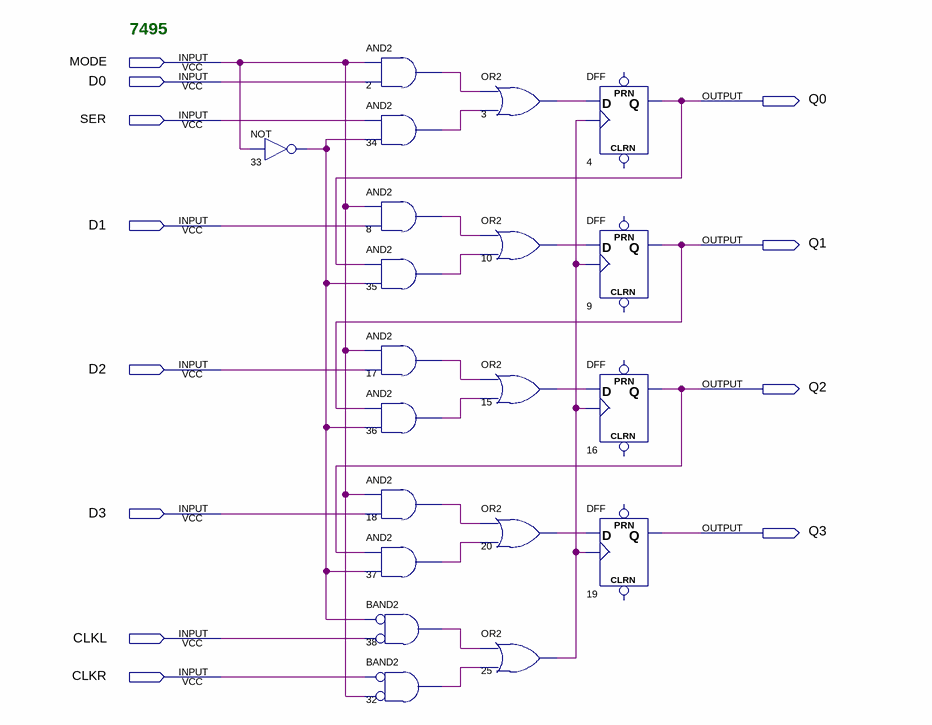
[diagram p0: schematic sheet]
// Quartus schematic 7495.bdf as structural Verilog: 20 symbols, 12 pins
module \7495  (
  input  MODE,
  input  D0,
  input  SER,
  input  D1,
  input  D2,
  input  D3,
  input  CLKL,
  input  CLKR,
  output Q0,
  output Q1,
  output Q2,
  output Q3
);

  wire n2_out, n3_out, n8_out, n10_out, n15_out, n17_out, n18_out, n20_out, n25_out, n32_out, n33_out,
       n34_out, n35_out, n36_out, n37_out, n38_out;

  not u_33 (n33_out, MODE);
  and u_2 (n2_out, MODE, D0);
  and u_34 (n34_out, SER, n33_out);
  and u_8 (n8_out, MODE, D1);
  and u_35 (n35_out, Q0, n33_out);
  and u_17 (n17_out, MODE, D2);
  and u_36 (n36_out, Q1, n33_out);
  and u_18 (n18_out, MODE, D3);
  and u_37 (n37_out, Q2, n33_out);
  and u_38 (n38_out, ~n33_out, ~CLKL);  // BAND2
  and u_32 (n32_out, ~CLKR, ~MODE);  // BAND2
  or u_3 (n3_out, n2_out, n34_out);
  or u_10 (n10_out, n8_out, n35_out);
  or u_15 (n15_out, n17_out, n36_out);
  or u_20 (n20_out, n18_out, n37_out);
  or u_25 (n25_out, n38_out, n32_out);
  DFF u_4 (.CLK(n25_out), .D(n3_out), .Q(Q0));  // open: CLRN, PRN
  DFF u_9 (.CLK(n25_out), .D(n10_out), .Q(Q1));  // open: CLRN, PRN
  DFF u_16 (.CLK(n25_out), .D(n15_out), .Q(Q2));  // open: CLRN, PRN
  DFF u_19 (.CLK(n25_out), .D(n20_out), .Q(Q3));  // open: CLRN, PRN

  // Notes on the sheet:
  //   7495
endmodule
